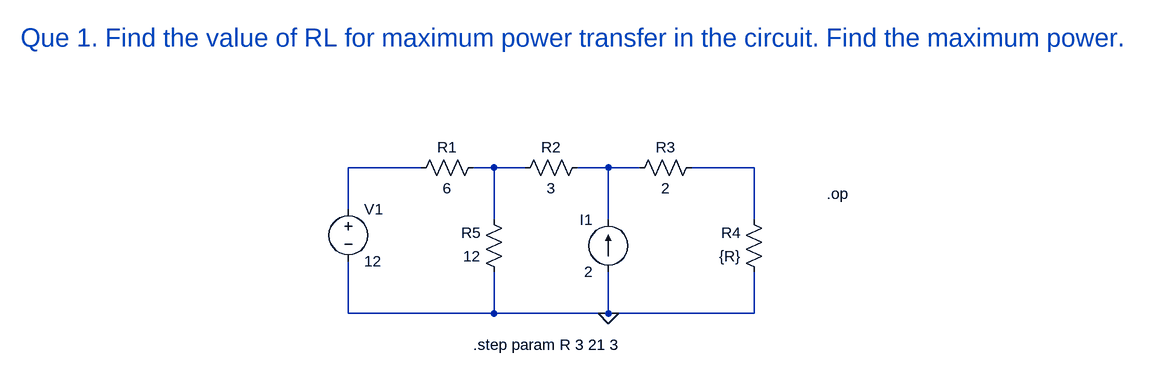
[diagram p0: schematic 1_Dheerendra_23EE019_Power_Transfer.asc]
1_Dheerendra_23EE019_Power_Transfer.asc, the LTspice schematic file:
Version 4
SHEET 1 1768 816
WIRE 512 176 400 176
WIRE 624 176 592 176
WIRE 672 176 624 176
WIRE 800 176 752 176
WIRE 848 176 800 176
WIRE 1024 176 928 176
WIRE 400 240 400 176
WIRE 624 256 624 176
WIRE 800 256 800 176
WIRE 1024 256 1024 176
WIRE 400 400 400 320
WIRE 624 400 624 336
WIRE 624 400 400 400
WIRE 800 400 800 336
WIRE 800 400 624 400
WIRE 1024 400 1024 336
WIRE 1024 400 800 400
FLAG 800 400 0
SYMBOL res 608 160 R90
WINDOW 0 0 56 VBottom 2
WINDOW 3 32 56 VTop 2
SYMATTR InstName R1
SYMATTR Value 6
SYMBOL res 768 160 R90
WINDOW 0 0 56 VBottom 2
WINDOW 3 32 56 VTop 2
SYMATTR InstName R2
SYMATTR Value 3
SYMBOL res 944 160 R90
WINDOW 0 0 56 VBottom 2
WINDOW 3 32 56 VTop 2
SYMATTR InstName R3
SYMATTR Value 2
SYMBOL res 1040 352 R180
WINDOW 0 36 76 Left 2
WINDOW 3 36 40 Left 2
SYMATTR InstName R4
SYMATTR Value {R}
SYMBOL res 640 352 R180
WINDOW 0 36 76 Left 2
WINDOW 3 36 40 Left 2
SYMATTR InstName R5
SYMATTR Value 12
SYMBOL voltage 400 224 R0
WINDOW 123 0 0 Left 0
WINDOW 39 0 0 Left 0
SYMATTR InstName V1
SYMATTR Value 12
SYMBOL current 800 336 R180
WINDOW 0 24 80 Left 2
WINDOW 3 24 0 Left 2
WINDOW 123 0 0 Left 0
WINDOW 39 0 0 Left 0
SYMATTR InstName I1
SYMATTR Value 2
TEXT -104 -24 Left 4 ;Que 1. Find the value of RL for maximum power transfer in the circuit. Find the maximum power.
TEXT 592 448 Left 2 !.step param R 3 21 3
TEXT 1136 216 Left 2 !.op

The netlist it stands for:
* 1_Dheerendra_23EE019_Power_Transfer.asc
R1 N002 N001 6
R2 N003 N002 3
R3 N004 N003 2
R4 0 N004 {R}
R5 0 N002 12
V1 N001 0 12
I1 0 N003 2
* Que 1. Find the value of RL for maximum power transfer in the circuit. Find the maximum power.
.step param R 3 21 3
.op
.backanno
.end